# Altium schematic sheet Power.SchDoc
size A4
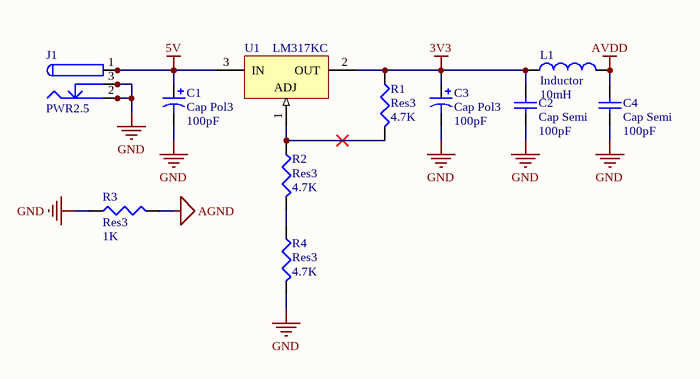
[diagram p0: Power.SchDoc]

## Parts
C1  Cap Pol3  value 100pF  [C0805]
C2  Cap Semi  value 100pF  [1608[0603]]
C3  Cap Pol3  value 100pF  [C0805]
C4  Cap Semi  value 100pF  [1608[0603]]
J1  PWR2.5  [KLD-0202]
L1  Inductor  value 10mH  [0402-A]
R1  Res3  value 4.7K  [J1-0603]
R2  Res3  value 4.7K  [J1-0603]
R3  Res3  value 1K  [J1-0603]
R4  Res3  value 4.7K  [J1-0603]
U1  LM317KC  [KC03]

## Nets
3V3: C2.2 C3.1 L1.1 R1.1 U1.2(OUT)
5V: C1.1 J1.1 J1.1A J1.1B U1.3(IN)
AGND: R3.2
AVDD: C4.2 L1.2
GND: C1.2 C2.1 C3.2 C4.1 J1.2 J1.2A J1.2B J1.3 J1.3A J1.3B R3.1 R4.2
NetR1_2: R1.2 R2.1 U1.1(ADJ)
NetR2_2: R2.2 R4.1

## Library data of the parts
C1 C3 = Cap Pol3: Polarized Capacitor (Surface Mount); Published: 8-Jun-2000; LatestRevisionDate: 29-May-2009; LatestRevisionNote: IPC-7351 Footprint Added.; PackageReference: C0805; Publisher: Altium Limited; PackageDescription: Chip Capacitor
C2 C4 = Cap Semi: Capacitor (Semiconductor SIM Model); Published: 8-Jun-2000; LatestRevisionDate: 29-May-2009; LatestRevisionNote: IPC-7351 Footprint Added.; PackageReference: C1206; Publisher: Altium Limited; PackageDescription: Chip Capacitor
J1 = PWR2.5: Low Voltage Power Supply Connector; Published: 17-Dec-2003; DatasheetDocument: 09-May-2002; Publisher: Altium Limited; ComponentLink1Description: Manufacturer Link; ComponentLink1URL: http://domino.kycon.com/internet/Products.html
L1 = Inductor: Code_IEC: 1005; Published: 8-Jun-2000; LatestRevisionDate: 29-May-2009; LatestRevisionNote: IPC-7351 Footprint Added.; PackageReference: 0402-A; Publisher: Altium Limited; PackageDescription: Chip Inductor; Code_JEITA: 0402
R1-R4 = Res3: Resistor; Published: 8-Jun-2000; LatestRevisionDate: 29-May-2009; LatestRevisionNote: IPC-7351 Footprint Added.; PackageReference: J1-0603; Publisher: Altium Limited; PackageDescription: Chip Resistor
U1 = LM317KC: 3-Terminal Adjustable Regulator; Note: Pin 2 is electrically connected to tab; Published: 15-Apr-2002; DatasheetVersion: Feb-1988; PackageVersion: Sep-1995; PackageReference: KC03; Publisher: Altium Limited; PackageDescription: TO, Thru-Hole, Vertical, Heatsink Mounted; 3 In-Line Leads; Pitch 2.54 mm; ComponentLink1Description: Manufacturer Link; ComponentLink1URL: http://www.ti.com/